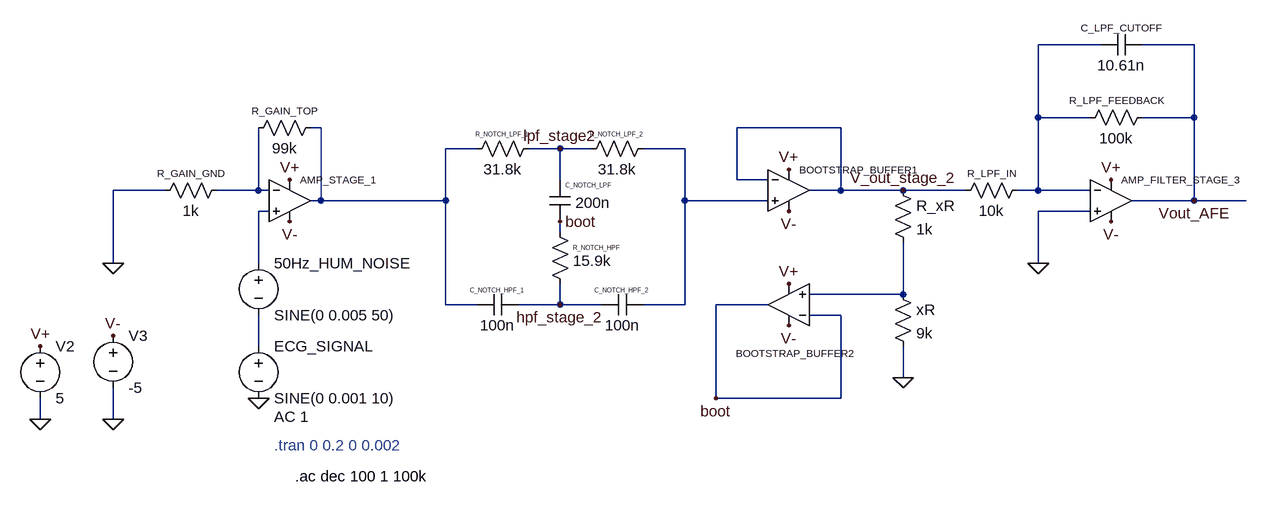
[diagram p0: schematic Draft1.asc]
Draft1.asc, the LTspice schematic file:
Version 4.1
SHEET 1 1572 680
WIRE 1136 -160 1040 -160
WIRE 1280 -160 1200 -160
WIRE 1040 -48 1040 -160
WIRE 1120 -48 1040 -48
WIRE 1280 -48 1280 -160
WIRE 1280 -48 1200 -48
WIRE -64 -32 -80 -32
WIRE 736 -32 576 -32
WIRE 176 0 128 0
WIRE 304 0 256 0
WIRE 352 0 304 0
WIRE 496 0 432 0
WIRE 304 48 304 0
WIRE 576 48 576 -32
WIRE 624 48 576 48
WIRE -304 64 -384 64
WIRE -160 64 -160 -32
WIRE -160 64 -224 64
WIRE -144 64 -160 64
WIRE 736 64 736 -32
WIRE 736 64 688 64
WIRE 832 64 736 64
WIRE 928 64 832 64
WIRE 1040 64 1040 -48
WIRE 1040 64 1008 64
WIRE 1120 64 1040 64
WIRE -64 80 -64 -32
WIRE -64 80 -80 80
WIRE 128 80 128 0
WIRE 128 80 -64 80
WIRE 496 80 496 0
WIRE 624 80 496 80
WIRE 1280 80 1280 -48
WIRE 1280 80 1184 80
WIRE 1360 80 1280 80
WIRE -144 96 -160 96
WIRE 1120 96 1040 96
WIRE 304 128 304 112
WIRE -384 176 -384 64
WIRE -160 176 -160 96
WIRE 1040 176 1040 96
WIRE 832 224 832 144
WIRE 832 224 688 224
WIRE 128 240 128 80
WIRE 176 240 128 240
WIRE 304 240 304 208
WIRE 304 240 240 240
WIRE 368 240 304 240
WIRE 496 240 496 80
WIRE 496 240 432 240
WIRE 624 240 544 240
WIRE 736 256 688 256
WIRE -160 304 -160 256
WIRE 832 352 832 304
WIRE 544 384 544 240
WIRE 736 384 736 256
WIRE 736 384 544 384
WIRE -496 416 -496 384
WIRE -384 416 -384 368
FLAG -384 176 0
FLAG -496 416 0
FLAG -384 416 0
FLAG -496 304 V+
FLAG -384 288 V-
FLAG -112 48 V+
FLAG -112 112 V-
FLAG 656 32 V+
FLAG 656 96 V-
FLAG -160 384 0
FLAG 1040 176 0
FLAG 1152 48 V+
FLAG 1152 112 V-
FLAG 1280 80 Vout_AFE
FLAG 656 208 V+
FLAG 656 272 V-
FLAG 832 352 0
FLAG 544 384 boot
FLAG 304 112 boot
FLAG 304 0 lpf_stage2
FLAG 304 240 hpf_stage_2
FLAG 832 64 V_out_stage_2
SYMBOL OpAmps\\UniversalOpAmp2 -112 80 R0
WINDOW 0 16 -32 Left 1
SYMATTR InstName AMP_STAGE_1
SYMBOL res -64 -48 R90
WINDOW 0 0 56 VBottom 1
WINDOW 3 32 56 VTop 2
SYMATTR InstName R_GAIN_TOP
SYMATTR Value 99k
SYMBOL res -208 48 R90
WINDOW 0 0 56 VBottom 1
WINDOW 3 32 56 VTop 2
SYMATTR InstName R_GAIN_GND
SYMATTR Value 1k
SYMBOL voltage -496 288 R0
WINDOW 123 0 0 Left 0
WINDOW 39 0 0 Left 0
SYMATTR InstName V2
SYMATTR Value 5
SYMBOL voltage -384 272 R0
WINDOW 123 0 0 Left 0
WINDOW 39 0 0 Left 0
SYMATTR InstName V3
SYMATTR Value -5
SYMBOL res 272 -16 R90
WINDOW 0 0 56 VBottom 0
WINDOW 3 32 56 VTop 2
SYMATTR InstName R_NOTCH_LPF_1
SYMATTR Value 31.8k
SYMBOL res 448 -16 R90
WINDOW 0 0 56 VBottom 0
WINDOW 3 32 56 VTop 2
SYMATTR InstName R_NOTCH_LPF_2
SYMATTR Value 31.8k
SYMBOL res 288 112 R0
WINDOW 0 36 40 Left 0
WINDOW 3 36 60 Left 2
SYMATTR InstName R_NOTCH_HPF
SYMATTR Value 15.9k
SYMBOL cap 240 224 R90
WINDOW 0 0 32 VBottom 0
WINDOW 3 32 32 VTop 2
SYMATTR InstName C_NOTCH_HPF_1
SYMATTR Value 100n
SYMBOL cap 432 224 R90
WINDOW 0 0 32 VBottom 0
WINDOW 3 32 32 VTop 2
SYMATTR InstName C_NOTCH_HPF_2
SYMATTR Value 100n
SYMBOL OpAmps\\UniversalOpAmp2 656 64 R0
WINDOW 0 16 -32 Left 1
SYMATTR InstName BOOTSTRAP_BUFFER1
SYMBOL cap 288 48 R0
WINDOW 0 24 8 Left 0
WINDOW 3 40 35 Left 2
SYMATTR InstName C_NOTCH_LPF
SYMATTR Value 200n
SYMBOL voltage -160 160 R0
WINDOW 123 0 0 Left 0
WINDOW 39 0 0 Left 0
SYMATTR InstName 50Hz_HUM_NOISE
SYMATTR Value SINE(0 0.005 50)
SYMBOL voltage -160 288 R0
WINDOW 123 24 124 Left 2
WINDOW 39 0 0 Left 0
SYMATTR InstName ECG_SIGNAL
SYMATTR Value SINE(0 0.001 10)
SYMATTR Value2 AC 1
SYMBOL OpAmps\\UniversalOpAmp2 1152 80 R0
WINDOW 0 16 -32 Left 1
SYMATTR InstName AMP_FILTER_STAGE_3
SYMBOL res 1024 48 R90
WINDOW 0 0 56 VBottom 1
WINDOW 3 32 56 VTop 2
SYMATTR InstName R_LPF_IN
SYMATTR Value 10k
SYMBOL res 1216 -64 R90
WINDOW 0 0 56 VBottom 1
WINDOW 3 32 56 VTop 2
SYMATTR InstName R_LPF_FEEDBACK
SYMATTR Value 100k
SYMBOL cap 1200 -176 R90
WINDOW 0 0 32 VBottom 1
WINDOW 3 32 32 VTop 2
SYMATTR InstName C_LPF_CUTOFF
SYMATTR Value 10.61n
SYMBOL OpAmps\\UniversalOpAmp2 656 240 R180
WINDOW 0 -99 -75 Left 1
SYMATTR InstName BOOTSTRAP_BUFFER2
SYMBOL res 816 48 R0
SYMATTR InstName R_xR
SYMATTR Value 1k
SYMBOL res 816 208 R0
SYMATTR InstName xR
SYMATTR Value 9k
TEXT -136 456 Left 2 ;.tran 0 0.2 0 0.002
TEXT -104 504 Left 2 !.ac dec 100 1 100k

The netlist it stands for:
* Draft1.asc
X§AMP_STAGE_1 N005 N004 V+ V- N002 level2 Avol=1Meg GBW=10Meg Slew=10Meg Ilimit=25m Rail=0 Vos=0 En=0 Enk=0 In=0 Ink=0 Rin=500Meg  ; pins In+ In- V+ V- OUT
R_GAIN_TOP N002 N004 99k
R_GAIN_GND N004 0 1k
V2 V+ 0 5
V3 V- 0 -5
R_NOTCH_LPF_1 lpf_stage2 N002 31.8k
R_NOTCH_LPF_2 N003 lpf_stage2 31.8k
R_NOTCH_HPF boot hpf_stage_2 15.9k
C_NOTCH_HPF_1 hpf_stage_2 N002 100n
C_NOTCH_HPF_2 N003 hpf_stage_2 100n
X§BOOTSTRAP_BUFFER1 N003 V_out_stage_2 V+ V- V_out_stage_2 level2 Avol=1Meg GBW=10Meg Slew=10Meg Ilimit=25m Rail=0 Vos=0 En=0 Enk=0 In=0 Ink=0 Rin=500Meg  ; pins In+ In- V+ V- OUT
C_NOTCH_LPF lpf_stage2 boot 200n
V§50Hz_HUM_NOISE N005 N007 SINE(0 0.005 50)
V§ECG_SIGNAL N007 0 SINE(0 0.001 10) AC 1
X§AMP_FILTER_STAGE_3 0 N001 V+ V- Vout_AFE level2 Avol=1Meg GBW=10Meg Slew=10Meg Ilimit=25m Rail=0 Vos=0 En=0 Enk=0 In=0 Ink=0 Rin=500Meg  ; pins In+ In- V+ V- OUT
R_LPF_IN N001 V_out_stage_2 10k
R_LPF_FEEDBACK Vout_AFE N001 100k
C_LPF_CUTOFF Vout_AFE N001 10.61n
X§BOOTSTRAP_BUFFER2 N006 boot V- V+ boot level2 Avol=1Meg GBW=10Meg Slew=10Meg Ilimit=25m Rail=0 Vos=0 En=0 Enk=0 In=0 Ink=0 Rin=500Meg  ; pins In+ In- V+ V- OUT
R_xR V_out_stage_2 N006 1k
R§xR N006 0 9k
* .tran 0 0.2 0 0.002
.ac dec 100 1 100k
.lib UniversalOpAmp2.lib
.backanno
.end